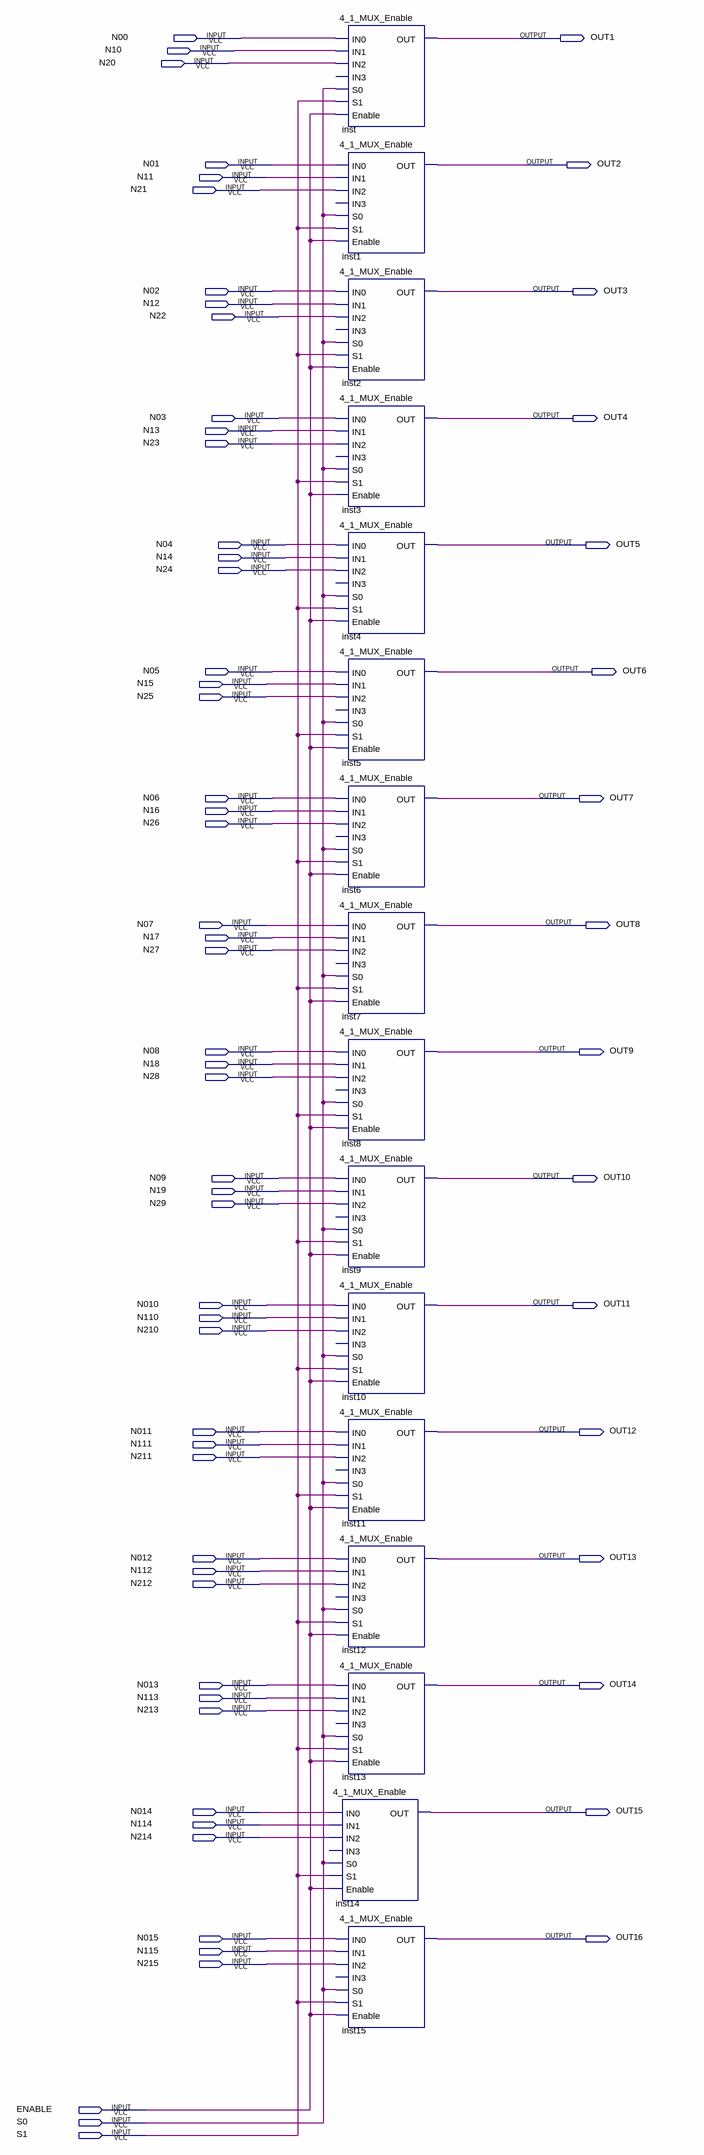
[diagram p0: schematic sheet]
// Quartus schematic 16_4_1_MUX.bdf as structural Verilog: 16 symbols, 67 pins
module \16_4_1_MUX  (
  input  N00,
  input  N10,
  input  N20,
  input  N01,
  input  N11,
  input  N21,
  input  N02,
  input  N12,
  input  N22,
  input  N03,
  input  N13,
  input  N23,
  input  N04,
  input  N14,
  input  N24,
  input  N05,
  input  N15,
  input  N25,
  input  N06,
  input  N16,
  input  N26,
  input  N07,
  input  N17,
  input  N27,
  input  N08,
  input  N18,
  input  N28,
  input  N09,
  input  N19,
  input  N29,
  input  N010,
  input  N110,
  input  N210,
  input  N011,
  input  N111,
  input  N211,
  input  N012,
  input  N112,
  input  N212,
  input  N013,
  input  N113,
  input  N213,
  input  N014,
  input  N114,
  input  N214,
  input  N015,
  input  N115,
  input  N215,
  input  ENABLE,
  input  S0,
  input  S1,
  output OUT1,
  output OUT2,
  output OUT3,
  output OUT4,
  output OUT5,
  output OUT6,
  output OUT7,
  output OUT8,
  output OUT9,
  output OUT10,
  output OUT11,
  output OUT12,
  output OUT13,
  output OUT14,
  output OUT15,
  output OUT16
);

  \4_1_MUX_Enable  inst (.IN0(N00), .IN1(N10), .IN2(N20), .S0(S0), .S1(S1), .Enable(ENABLE), .OUT(OUT1));  // open: IN3
  \4_1_MUX_Enable  inst1 (.IN0(N01), .IN1(N11), .IN2(N21), .S0(S0), .S1(S1), .Enable(ENABLE), .OUT(OUT2));  // open: IN3
  \4_1_MUX_Enable  inst2 (.IN0(N02), .IN1(N12), .IN2(N22), .S0(S0), .S1(S1), .Enable(ENABLE), .OUT(OUT3));  // open: IN3
  \4_1_MUX_Enable  inst3 (.IN0(N03), .IN1(N13), .IN2(N23), .S0(S0), .S1(S1), .Enable(ENABLE), .OUT(OUT4));  // open: IN3
  \4_1_MUX_Enable  inst4 (.IN0(N04), .IN1(N14), .IN2(N24), .S0(S0), .S1(S1), .Enable(ENABLE), .OUT(OUT5));  // open: IN3
  \4_1_MUX_Enable  inst5 (.IN0(N05), .IN1(N15), .IN2(N25), .S0(S0), .S1(S1), .Enable(ENABLE), .OUT(OUT6));  // open: IN3
  \4_1_MUX_Enable  inst6 (.IN0(N06), .IN1(N16), .IN2(N26), .S0(S0), .S1(S1), .Enable(ENABLE), .OUT(OUT7));  // open: IN3
  \4_1_MUX_Enable  inst7 (.IN0(N07), .IN1(N17), .IN2(N27), .S0(S0), .S1(S1), .Enable(ENABLE), .OUT(OUT8));  // open: IN3
  \4_1_MUX_Enable  inst8 (.IN0(N08), .IN1(N18), .IN2(N28), .S0(S0), .S1(S1), .Enable(ENABLE), .OUT(OUT9));  // open: IN3
  \4_1_MUX_Enable  inst9 (
    .IN0(N09), .IN1(N19), .IN2(N29), .S0(S0), .S1(S1), .Enable(ENABLE), .OUT(OUT10));  // open: IN3
  \4_1_MUX_Enable  inst10 (
    .IN0(N010), .IN1(N110), .IN2(N210), .S0(S0), .S1(S1), .Enable(ENABLE), .OUT(OUT11));  // open: IN3
  \4_1_MUX_Enable  inst11 (
    .IN0(N011), .IN1(N111), .IN2(N211), .S0(S0), .S1(S1), .Enable(ENABLE), .OUT(OUT12));  // open: IN3
  \4_1_MUX_Enable  inst12 (
    .IN0(N012), .IN1(N112), .IN2(N212), .S0(S0), .S1(S1), .Enable(ENABLE), .OUT(OUT13));  // open: IN3
  \4_1_MUX_Enable  inst13 (
    .IN0(N013), .IN1(N113), .IN2(N213), .S0(S0), .S1(S1), .Enable(ENABLE), .OUT(OUT14));  // open: IN3
  \4_1_MUX_Enable  inst14 (
    .IN0(N014), .IN1(N114), .IN2(N214), .S0(S0), .S1(S1), .Enable(ENABLE), .OUT(OUT15));  // open: IN3
  \4_1_MUX_Enable  inst15 (
    .IN0(N015), .IN1(N115), .IN2(N215), .S0(S0), .S1(S1), .Enable(ENABLE), .OUT(OUT16));  // open: IN3
endmodule
